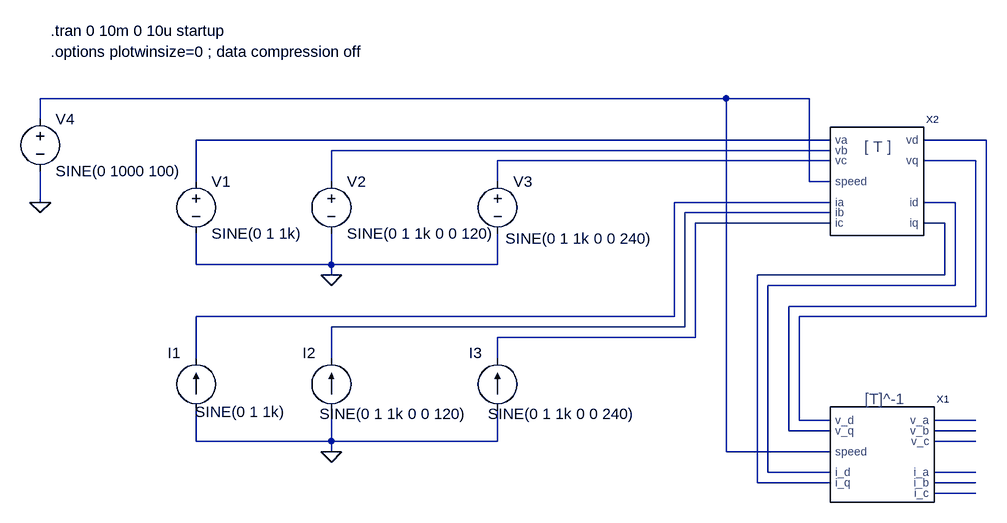
[diagram p0: schematic test models1.asc]
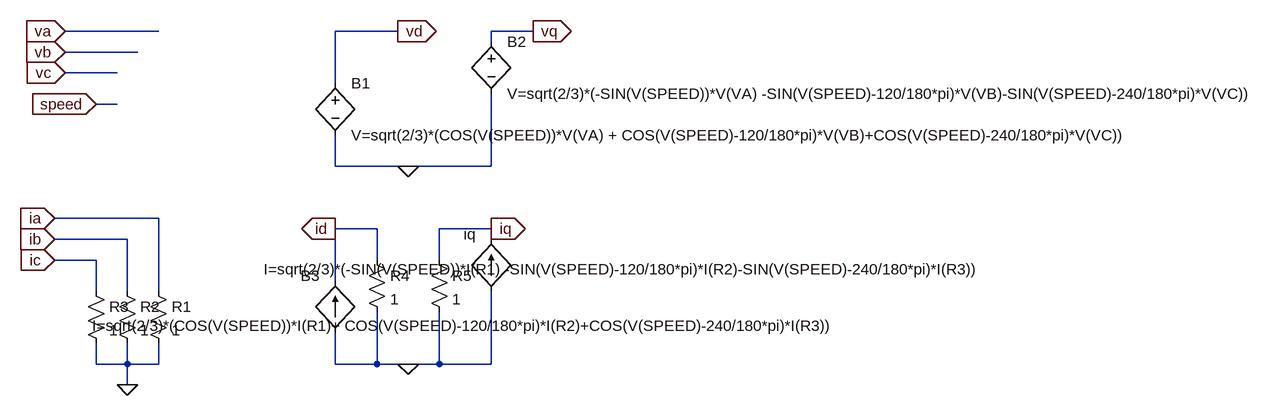
[diagram p1: sub-circuit abc-dq.asc]
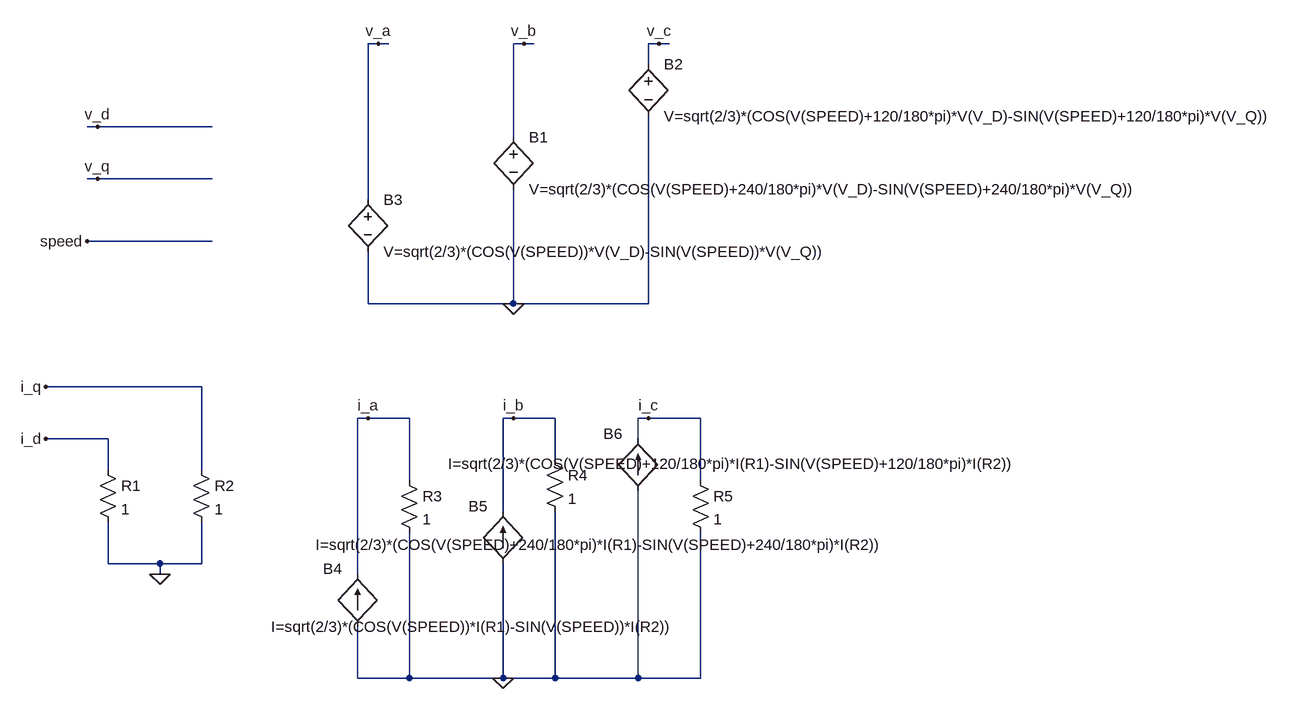
[diagram p2: sub-circuit dq-abc.asc]
test models1.asc, the LTspice schematic file:
Version 4
SHEET 1 880 680
WIRE -448 -64 -1504 -64
WIRE -320 -64 -448 -64
WIRE -1504 -32 -1504 -64
WIRE -288 0 -1264 0
WIRE -48 0 -144 0
WIRE -288 16 -1056 16
WIRE -288 32 -800 32
WIRE -64 32 -144 32
WIRE -1264 64 -1264 0
WIRE -1056 64 -1056 16
WIRE -800 64 -800 32
WIRE -320 64 -320 -64
WIRE -288 64 -320 64
WIRE -1504 96 -1504 48
WIRE -288 96 -528 96
WIRE -96 96 -144 96
WIRE -288 112 -512 112
WIRE -288 128 -496 128
WIRE -112 128 -144 128
WIRE -1264 192 -1264 144
WIRE -1056 192 -1056 144
WIRE -1056 192 -1264 192
WIRE -800 192 -800 144
WIRE -800 192 -1056 192
WIRE -1056 208 -1056 192
WIRE -112 208 -112 128
WIRE -112 208 -400 208
WIRE -96 224 -96 96
WIRE -96 224 -384 224
WIRE -64 256 -64 32
WIRE -64 256 -352 256
WIRE -528 272 -528 96
WIRE -528 272 -1264 272
WIRE -48 272 -48 0
WIRE -48 272 -336 272
WIRE -512 288 -512 112
WIRE -512 288 -1056 288
WIRE -496 304 -496 128
WIRE -496 304 -800 304
WIRE -1264 336 -1264 272
WIRE -1056 336 -1056 288
WIRE -800 336 -800 304
WIRE -336 432 -336 272
WIRE -288 432 -336 432
WIRE -64 432 -128 432
WIRE -352 448 -352 256
WIRE -288 448 -352 448
WIRE -64 448 -128 448
WIRE -1264 464 -1264 416
WIRE -1056 464 -1056 416
WIRE -1056 464 -1264 464
WIRE -800 464 -800 416
WIRE -800 464 -1056 464
WIRE -64 464 -128 464
WIRE -1056 480 -1056 464
WIRE -448 480 -448 -64
WIRE -288 480 -448 480
WIRE -384 512 -384 224
WIRE -288 512 -384 512
WIRE -64 512 -128 512
WIRE -400 528 -400 208
WIRE -288 528 -400 528
WIRE -64 528 -128 528
WIRE -64 544 -128 544
FLAG -1056 208 0
FLAG -1056 480 0
FLAG -1504 96 0
SYMBOL voltage -1264 48 R0
WINDOW 123 0 0 Left 0
WINDOW 39 0 0 Left 0
SYMATTR InstName V1
SYMATTR Value SINE(0 1 1k)
SYMBOL voltage -1056 48 R0
WINDOW 123 0 0 Left 0
WINDOW 39 0 0 Left 0
SYMATTR InstName V2
SYMATTR Value SINE(0 1 1k 0 0 120)
SYMBOL voltage -800 48 R0
WINDOW 123 0 0 Left 0
WINDOW 39 0 0 Left 0
WINDOW 3 12 104 Left 0
SYMATTR Value SINE(0 1 1k 0 0 240)
SYMATTR InstName V3
SYMBOL current -1264 416 R180
WINDOW 0 24 88 Left 0
WINDOW 3 -136 -3 Left 0
WINDOW 123 0 0 Left 0
WINDOW 39 0 0 Left 0
SYMATTR InstName I1
SYMATTR Value SINE(0 1 1k)
SYMBOL current -1056 416 R180
WINDOW 0 24 88 Left 0
WINDOW 3 -208 -6 Left 0
WINDOW 123 0 0 Left 0
WINDOW 39 0 0 Left 0
SYMATTR InstName I2
SYMATTR Value SINE(0 1 1k 0 0 120)
SYMBOL current -800 416 R180
WINDOW 0 24 88 Left 0
WINDOW 3 -211 -6 Left 0
WINDOW 123 0 0 Left 0
WINDOW 39 0 0 Left 0
SYMATTR InstName I3
SYMATTR Value SINE(0 1 1k 0 0 240)
SYMBOL voltage -1504 -48 R0
WINDOW 123 0 0 Left 0
WINDOW 39 0 0 Left 0
SYMATTR InstName V4
SYMATTR Value SINE(0 1000 100)
SYMBOL abc-dq -208 80 R0
SYMATTR InstName X2
SYMBOL dq-abc -224 480 R0
SYMATTR InstName X1
TEXT -1488 -168 Left 0 !.tran 0 10m 0 10u startup
TEXT -1488 -136 Left 0 !.options plotwinsize=0 ; data compression off

abc-dq.asc, the sub-circuit schematic file:
Version 4
SHEET 1 1560 936
WIRE -272 112 -416 112
WIRE 96 112 0 112
WIRE 304 112 240 112
WIRE 240 128 240 112
WIRE -304 144 -416 144
WIRE -336 176 -416 176
WIRE 0 192 0 112
WIRE -336 224 -368 224
WIRE 0 320 0 272
WIRE 112 320 0 320
WIRE 240 320 240 208
WIRE 240 320 112 320
WIRE -272 400 -432 400
WIRE 64 416 0 416
WIRE 240 416 160 416
WIRE -320 432 -432 432
WIRE 240 432 240 416
WIRE -368 464 -432 464
WIRE 64 464 64 416
WIRE 160 464 160 416
WIRE 0 496 0 416
WIRE -368 512 -368 464
WIRE -320 512 -320 432
WIRE -272 512 -272 400
WIRE -368 624 -368 592
WIRE -320 624 -320 592
WIRE -320 624 -368 624
WIRE -272 624 -272 592
WIRE -272 624 -320 624
WIRE 0 624 0 576
WIRE 64 624 64 544
WIRE 64 624 0 624
WIRE 112 624 64 624
WIRE 160 624 160 544
WIRE 160 624 112 624
WIRE 240 624 240 512
WIRE 240 624 160 624
WIRE -320 656 -320 624
FLAG 96 112 vd
IOPIN 96 112 Out
FLAG 304 112 vq
IOPIN 304 112 Out
FLAG 112 320 0
FLAG -416 112 va
IOPIN -416 112 In
FLAG -416 144 vb
IOPIN -416 144 In
FLAG -416 176 vc
IOPIN -416 176 In
FLAG -368 224 speed
IOPIN -368 224 In
FLAG 0 416 id
IOPIN 0 416 Out
FLAG 240 416 iq
IOPIN 240 416 Out
FLAG 112 624 0
FLAG -432 400 ia
IOPIN -432 400 In
FLAG -432 432 ib
IOPIN -432 432 In
FLAG -432 464 ic
IOPIN -432 464 In
FLAG -320 656 0
SYMBOL bv 0 176 R0
SYMATTR InstName B1
SYMATTR Value V=sqrt(2/3)*(COS(V(SPEED))*V(VA) + COS(V(SPEED)-120/180*pi)*V(VB)+COS(V(SPEED)-240/180*pi)*V(VC))
SYMBOL bv 240 112 R0
SYMATTR InstName B2
SYMATTR Value V=sqrt(2/3)*(-SIN(V(SPEED))*V(VA) -SIN(V(SPEED)-120/180*pi)*V(VB)-SIN(V(SPEED)-240/180*pi)*V(VC))
SYMBOL bi 0 576 R180
WINDOW 0 24 88 Left 0
WINDOW 3 -777 11 Left 0
SYMATTR InstName B3
SYMATTR Value I=sqrt(2/3)*(COS(V(SPEED))*I(R1)+ COS(V(SPEED)-120/180*pi)*I(R2)+COS(V(SPEED)-240/180*pi)*I(R3))
SYMBOL bi 240 512 R180
WINDOW 0 24 88 Left 0
WINDOW 3 -761 34 Left 0
SYMATTR InstName iq
SYMATTR Value I=sqrt(2/3)*(-SIN(V(SPEED))*I(R1) -SIN(V(SPEED)-120/180*pi)*I(R2)-SIN(V(SPEED)-240/180*pi)*I(R3))
SYMBOL res -288 496 R0
SYMATTR InstName R1
SYMATTR Value 1
SYMBOL res -336 496 R0
SYMATTR InstName R2
SYMATTR Value 1
SYMBOL res -384 496 R0
SYMATTR InstName R3
SYMATTR Value 1
SYMBOL res 48 448 R0
SYMATTR InstName R4
SYMATTR Value 1
SYMBOL res 144 448 R0
SYMATTR InstName R5
SYMATTR Value 1

dq-abc.asc, the sub-circuit schematic file:
Version 4
SHEET 1 920 900
WIRE -576 -96 -592 -96
WIRE -560 -96 -576 -96
WIRE -352 -96 -368 -96
WIRE -336 -96 -352 -96
WIRE -144 -96 -160 -96
WIRE -128 -96 -144 -96
WIRE -160 -64 -160 -96
WIRE -1008 32 -1024 32
WIRE -832 32 -1008 32
WIRE -368 48 -368 -96
WIRE -1008 112 -1024 112
WIRE -832 112 -1008 112
WIRE -592 144 -592 -96
WIRE -832 208 -1024 208
WIRE -592 304 -592 224
WIRE -368 304 -368 128
WIRE -368 304 -592 304
WIRE -160 304 -160 16
WIRE -160 304 -368 304
WIRE -848 432 -1088 432
WIRE -592 480 -608 480
WIRE -528 480 -592 480
WIRE -368 480 -384 480
WIRE -304 480 -368 480
WIRE -160 480 -176 480
WIRE -80 480 -160 480
WIRE -992 512 -1088 512
WIRE -176 512 -176 480
WIRE -304 544 -304 480
WIRE -992 560 -992 512
WIRE -848 560 -848 432
WIRE -528 576 -528 480
WIRE -80 576 -80 480
WIRE -384 624 -384 480
WIRE -992 704 -992 640
WIRE -912 704 -992 704
WIRE -848 704 -848 640
WIRE -848 704 -912 704
WIRE -912 720 -912 704
WIRE -608 720 -608 480
WIRE -608 880 -608 800
WIRE -528 880 -528 656
WIRE -528 880 -608 880
WIRE -384 880 -384 704
WIRE -384 880 -528 880
WIRE -304 880 -304 624
WIRE -304 880 -384 880
WIRE -176 880 -176 592
WIRE -176 880 -304 880
WIRE -80 880 -80 656
WIRE -80 880 -176 880
FLAG -368 304 0
FLAG -576 -96 v_a
FLAG -352 -96 v_b
FLAG -144 -96 v_c
FLAG -1008 32 v_d
FLAG -1008 112 v_q
FLAG -1024 208 speed
FLAG -912 720 0
FLAG -1088 512 i_d
FLAG -1088 432 i_q
FLAG -384 880 0
FLAG -592 480 i_a
FLAG -368 480 i_b
FLAG -160 480 i_c
SYMBOL bv -368 32 R0
SYMATTR InstName B1
SYMATTR Value V=sqrt(2/3)*(COS(V(SPEED)+240/180*pi)*V(V_D)-SIN(V(SPEED)+240/180*pi)*V(V_Q))
SYMBOL bv -160 -80 R0
SYMATTR InstName B2
SYMATTR Value V=sqrt(2/3)*(COS(V(SPEED)+120/180*pi)*V(V_D)-SIN(V(SPEED)+120/180*pi)*V(V_Q))
SYMBOL bv -592 128 R0
SYMATTR InstName B3
SYMATTR Value V=sqrt(2/3)*(COS(V(SPEED))*V(V_D)-SIN(V(SPEED))*V(V_Q))
SYMBOL res -1008 544 R0
SYMATTR InstName R1
SYMATTR Value 1
SYMBOL res -864 544 R0
SYMATTR InstName R2
SYMATTR Value 1
SYMBOL bi -608 800 R180
WINDOW 0 24 88 Left 0
WINDOW 3 -488 -1 Left 0
SYMATTR InstName B4
SYMATTR Value I=sqrt(2/3)*(COS(V(SPEED))*I(R1)-SIN(V(SPEED))*I(R2))
SYMBOL bi -384 704 R180
WINDOW 0 24 88 Left 0
WINDOW 3 -592 29 Left 0
SYMATTR InstName B5
SYMATTR Value I=sqrt(2/3)*(COS(V(SPEED)+240/180*pi)*I(R1)-SIN(V(SPEED)+240/180*pi)*I(R2))
SYMBOL bi -176 592 R180
WINDOW 0 24 88 Left 0
WINDOW 3 -588 42 Left 0
SYMATTR InstName B6
SYMATTR Value I=sqrt(2/3)*(COS(V(SPEED)+120/180*pi)*I(R1)-SIN(V(SPEED)+120/180*pi)*I(R2))
SYMBOL res -544 560 R0
SYMATTR InstName R3
SYMATTR Value 1
SYMBOL res -320 528 R0
SYMATTR InstName R4
SYMATTR Value 1
SYMBOL res -96 560 R0
SYMATTR InstName R5
SYMATTR Value 1

The netlist it stands for:
* test models1.asc
V1 N002 0 SINE(0 1 1k)
V2 N004 0 SINE(0 1 1k 0 0 120)
V3 N005 0 SINE(0 1 1k 0 0 240)
I1 0 N007 SINE(0 1 1k)
I2 0 N009 SINE(0 1 1k 0 0 120)
I3 0 N010 SINE(0 1 1k 0 0 240)
V4 N001 0 SINE(0 1000 100)
XX2 N002 N004 N005 N001 N007 N009 N010 N003 N006 N008 N011 abc-dq params: abc-dq
XX1 N003 N006 N001 N008 N011 N012 N013 N014 N015 N016 N017 dq-abc params: da-abc

* block symbol definitions
.subckt abc-dq va vb vc speed ia ib ic vd vq id iq
B1 vd 0 V=sqrt(2/3)*(COS(V(SPEED))*V(VA) + COS(V(SPEED)-120/180*pi)*V(VB)+COS(V(SPEED)-240/180*pi)*V(VC))
B2 vq 0 V=sqrt(2/3)*(-SIN(V(SPEED))*V(VA) -SIN(V(SPEED)-120/180*pi)*V(VB)-SIN(V(SPEED)-240/180*pi)*V(VC))
B3 0 id I=sqrt(2/3)*(COS(V(SPEED))*I(R1)+ COS(V(SPEED)-120/180*pi)*I(R2)+COS(V(SPEED)-240/180*pi)*I(R3))
B§iq 0 iq I=sqrt(2/3)*(-SIN(V(SPEED))*I(R1) -SIN(V(SPEED)-120/180*pi)*I(R2)-SIN(V(SPEED)-240/180*pi)*I(R3))
R1 ia 0 1
R2 ib 0 1
R3 ic 0 1
R4 id 0 1
R5 iq 0 1
.ends abc-dq

.subckt dq-abc v_d v_q speed i_d i_q v_a v_b v_c i_a i_b i_c
B1 v_b 0 V=sqrt(2/3)*(COS(V(SPEED)+240/180*pi)*V(V_D)-SIN(V(SPEED)+240/180*pi)*V(V_Q))
B2 v_c 0 V=sqrt(2/3)*(COS(V(SPEED)+120/180*pi)*V(V_D)-SIN(V(SPEED)+120/180*pi)*V(V_Q))
B3 v_a 0 V=sqrt(2/3)*(COS(V(SPEED))*V(V_D)-SIN(V(SPEED))*V(V_Q))
R1 i_d 0 1
R2 i_q 0 1
B4 0 i_a I=sqrt(2/3)*(COS(V(SPEED))*I(R1)-SIN(V(SPEED))*I(R2))
B5 0 i_b I=sqrt(2/3)*(COS(V(SPEED)+240/180*pi)*I(R1)-SIN(V(SPEED)+240/180*pi)*I(R2))
B6 0 i_c I=sqrt(2/3)*(COS(V(SPEED)+120/180*pi)*I(R1)-SIN(V(SPEED)+120/180*pi)*I(R2))
R3 i_a 0 1
R4 i_b 0 1
R5 i_c 0 1
.ends dq-abc

.tran 0 10m 0 10u startup
.options plotwinsize=0 ; data compression off
.backanno
.end